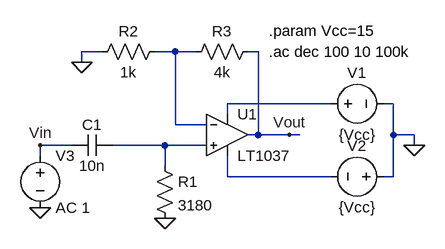
[diagram p0: schematic scheme2.asc]
scheme2.asc, the LTspice schematic file:
Version 4.1
SHEET 1 880 680
WIRE 16 128 -16 128
WIRE 128 128 96 128
WIRE 160 128 128 128
WIRE 256 128 240 128
WIRE -16 144 -16 128
WIRE 368 208 208 208
WIRE 464 208 448 208
WIRE 208 224 208 208
WIRE 128 240 128 128
WIRE 176 240 128 240
WIRE 256 256 256 128
WIRE 256 256 240 256
WIRE 304 256 256 256
WIRE 320 256 304 256
WIRE 464 256 464 208
WIRE 496 256 464 256
WIRE -32 272 -80 272
WIRE 112 272 32 272
WIRE 176 272 112 272
WIRE 496 272 496 256
WIRE -80 288 -80 272
WIRE 112 304 112 272
WIRE 208 320 208 288
WIRE 368 320 208 320
WIRE 464 320 464 256
WIRE 464 320 448 320
FLAG 496 272 0
FLAG 112 384 0
FLAG -16 144 0
FLAG -80 368 0
FLAG -80 272 Vin
FLAG 304 256 Vout
SYMBOL OpAmps\\LT1037 208 192 R0
SYMATTR InstName U1
SYMBOL voltage 352 208 R270
WINDOW 0 32 56 VTop 2
WINDOW 3 -32 56 VBottom 2
SYMATTR InstName V1
SYMATTR Value {Vcc}
SYMBOL voltage 464 320 R90
WINDOW 0 -32 56 VBottom 2
WINDOW 3 32 56 VTop 2
SYMATTR InstName V2
SYMATTR Value {Vcc}
SYMBOL cap 32 256 R90
WINDOW 0 0 32 VBottom 2
WINDOW 3 32 32 VTop 2
SYMATTR InstName C1
SYMATTR Value 10n
SYMBOL res 96 288 R0
SYMATTR InstName R1
SYMATTR Value 3180
SYMBOL res 112 112 R90
WINDOW 0 0 56 VBottom 2
WINDOW 3 32 56 VTop 2
SYMATTR InstName R2
SYMATTR Value 1k
SYMBOL res 256 112 R90
WINDOW 0 0 56 VBottom 2
WINDOW 3 32 56 VTop 2
SYMATTR InstName R3
SYMATTR Value 4k
SYMBOL voltage -80 272 R0
SYMATTR InstName V3
SYMATTR Value AC 1
TEXT 272 96 Left 2 !.param Vcc=15
TEXT 272 128 Left 2 !.ac dec 100 10 100k

The netlist it stands for:
* scheme2.asc
X§U1 N003 N001 N002 N004 Vout LT1037  ; pins In+ In- V+ V- OUT
V1 N002 0 {Vcc}
V2 0 N004 {Vcc}
C1 N003 Vin 10n
R1 N003 0 3180
R2 N001 0 1k
R3 Vout N001 4k
V3 Vin 0 AC 1
.param Vcc=15
.ac dec 100 10 100k
.backanno
.end